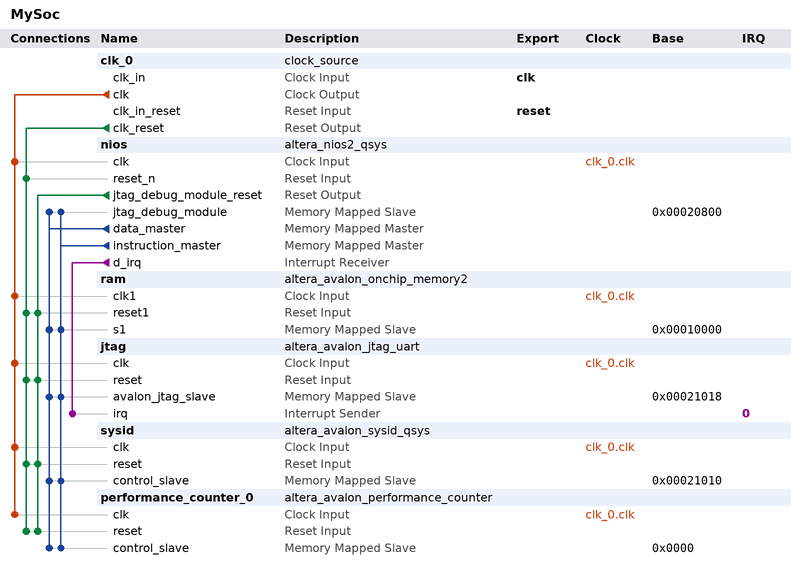
[diagram p0: system contents]
# Platform Designer (Qsys) system MySoc, Cyclone III EP3C25F324C6
# Parameters at their usual value, and those the tool derives, are not listed.
package require -exact qsys 13.0
create_system MySoc
set_project_property DEVICE_FAMILY {Cyclone III}
set_project_property DEVICE EP3C25F324C6

add_instance clk_0 clock_source 13.0
set_instance_parameter_value clk_0 clockFrequency 50000000

add_instance nios altera_nios2_qsys 13.0
set_instance_parameter_value nios resetSlave ram.s1
set_instance_parameter_value nios mmu_TLBMissExcSlave None
set_instance_parameter_value nios exceptionSlave ram.s1
set_instance_parameter_value nios breakSlave nios.jtag_debug_module
set_instance_parameter_value nios impl Tiny
set_instance_parameter_value nios icache_size 4096

add_instance ram altera_avalon_onchip_memory2 13.0.1.99.2
set_instance_parameter_value ram dataWidth 32
set_instance_parameter_value ram dualPort false
set_instance_parameter_value ram initMemContent true
set_instance_parameter_value ram initializationFileName onchip_mem.hex
set_instance_parameter_value ram memorySize 40960

add_instance jtag altera_avalon_jtag_uart 13.0.1.99.2
set_instance_parameter_value jtag simInteractiveOptions NO_INTERACTIVE_WINDOWS

add_instance sysid altera_avalon_sysid_qsys 13.0
set_instance_parameter_value sysid id 0

add_instance performance_counter_0 altera_avalon_performance_counter 13.0.1.99.2
set_instance_parameter_value performance_counter_0 numberOfSections 3

# connections
add_connection clk_0.clk jtag.clk clock
add_connection clk_0.clk nios.clk clock
add_connection clk_0.clk performance_counter_0.clk clock
add_connection clk_0.clk ram.clk1 clock
add_connection clk_0.clk sysid.clk clock
add_connection clk_0.clk_reset jtag.reset reset
add_connection clk_0.clk_reset nios.reset_n reset
add_connection clk_0.clk_reset performance_counter_0.reset reset
add_connection clk_0.clk_reset ram.reset1 reset
add_connection clk_0.clk_reset sysid.reset reset
add_connection nios.jtag_debug_module_reset jtag.reset reset
add_connection nios.jtag_debug_module_reset performance_counter_0.reset reset
add_connection nios.jtag_debug_module_reset ram.reset1 reset
add_connection nios.jtag_debug_module_reset sysid.reset reset
add_connection nios.data_master jtag.avalon_jtag_slave avalon
set_connection_parameter_value nios.data_master/jtag.avalon_jtag_slave baseAddress 0x00021018
add_connection nios.data_master nios.jtag_debug_module avalon
set_connection_parameter_value nios.data_master/nios.jtag_debug_module baseAddress 0x00020800
add_connection nios.data_master performance_counter_0.control_slave avalon
set_connection_parameter_value nios.data_master/performance_counter_0.control_slave baseAddress 0x0000
add_connection nios.data_master ram.s1 avalon
set_connection_parameter_value nios.data_master/ram.s1 baseAddress 0x00010000
add_connection nios.data_master sysid.control_slave avalon
set_connection_parameter_value nios.data_master/sysid.control_slave baseAddress 0x00021010
add_connection nios.instruction_master jtag.avalon_jtag_slave avalon
set_connection_parameter_value nios.instruction_master/jtag.avalon_jtag_slave baseAddress 0x00021018
add_connection nios.instruction_master nios.jtag_debug_module avalon
set_connection_parameter_value nios.instruction_master/nios.jtag_debug_module baseAddress 0x00020800
add_connection nios.instruction_master performance_counter_0.control_slave avalon
set_connection_parameter_value nios.instruction_master/performance_counter_0.control_slave baseAddress 0x0000
add_connection nios.instruction_master ram.s1 avalon
set_connection_parameter_value nios.instruction_master/ram.s1 baseAddress 0x00010000
add_connection nios.instruction_master sysid.control_slave avalon
set_connection_parameter_value nios.instruction_master/sysid.control_slave baseAddress 0x00021010
add_connection nios.d_irq jtag.irq interrupt
set_connection_parameter_value nios.d_irq/jtag.irq irqNumber 0

# exported interfaces
add_interface clk clock sink
set_interface_property clk EXPORT_OF clk_0.clk_in
add_interface reset reset sink
set_interface_property reset EXPORT_OF clk_0.clk_in_reset

set_interconnect_requirement {$system} qsys_mm.clockCrossingAdapter HANDSHAKE
set_interconnect_requirement {$system} qsys_mm.maxAdditionalLatency 1

save_system MySoc.qsys
